# Altium schematic sheet HDMI.SchDoc
size A4; SheetNumber: 11; SheetTotal: 11
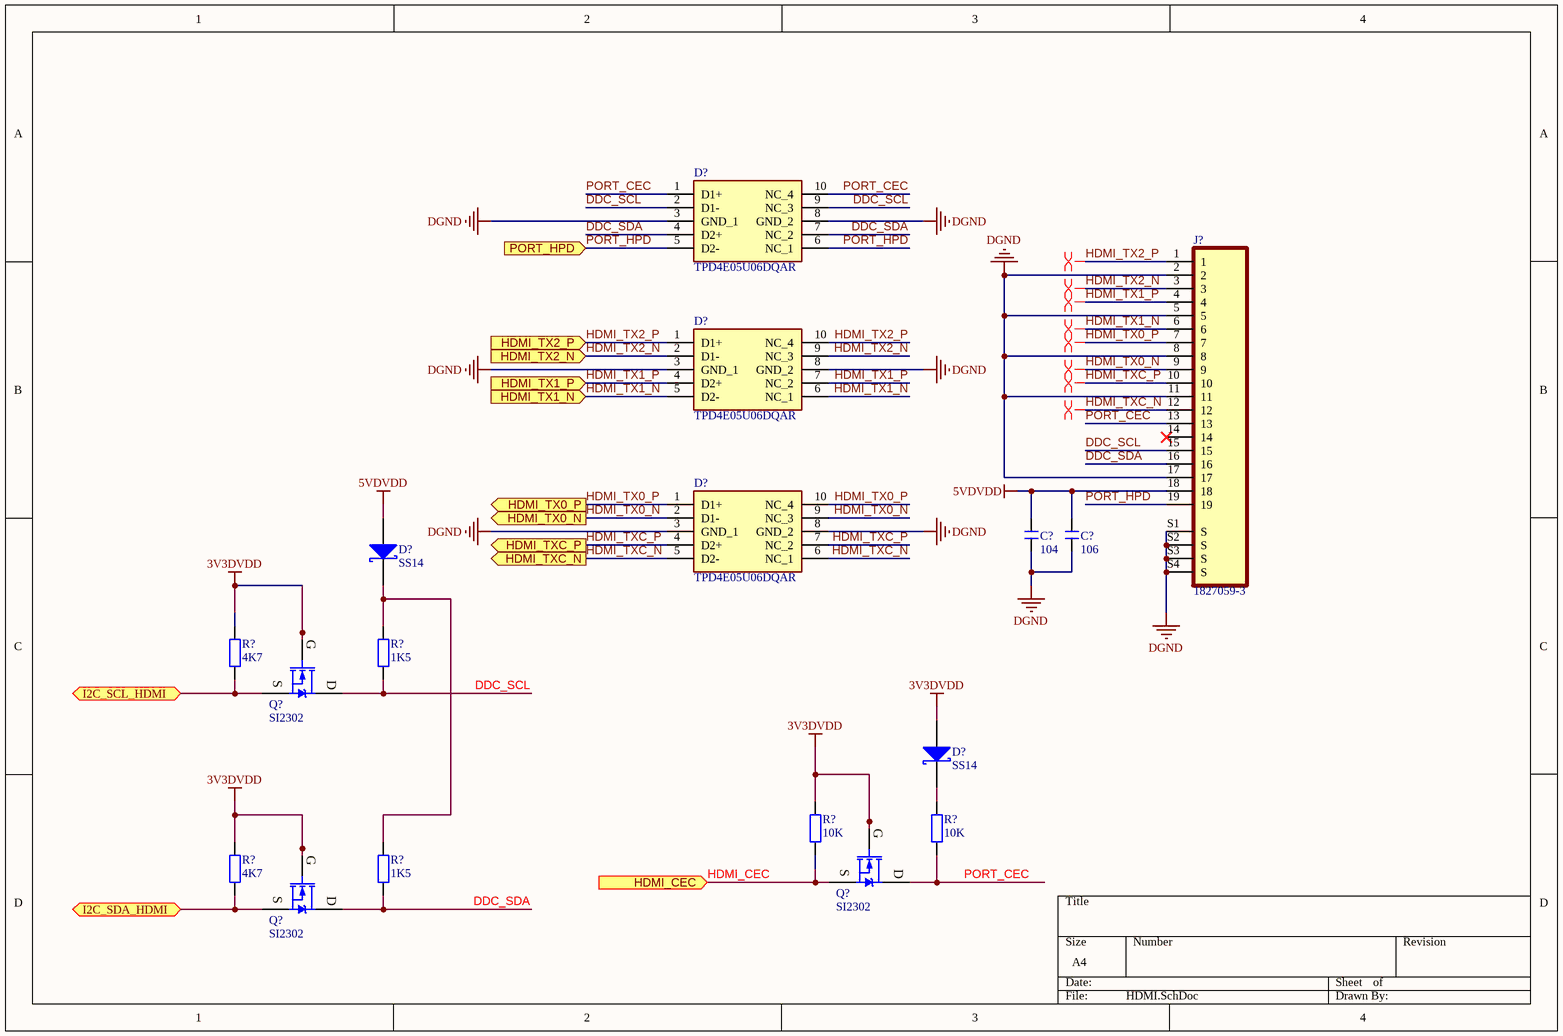
[diagram p0: HDMI.SchDoc]

## Parts
(Parts that share a designator on the sheet are numbered #1, #2 ... from top to bottom, then left to right.)
C?#1  104  [C 0603_L]
C?#2  106  [C 0603_L]
D?#1  TPD4E05U06DQAR  [DQA(R-PUSON-N10)]
D?#2  TPD4E05U06DQAR  [DQA(R-PUSON-N10)]
D?#3  TPD4E05U06DQAR  [DQA(R-PUSON-N10)]
D?#4  SS14  [SMA]
D?#5  SS14  [SMA]
J?  1827059-3  [TE_1827059-3]
Q?#1  SI2302  [SOT23-3N]
Q?#2  SI2302  [SOT23-3N]
Q?#3  SI2302  [SOT23-3N]
R?#1  4K7  [R 0603_L]
R?#2  1K5  [R 0603_L]
R?#3  10K  [R 0603_L]
R?#4  10K  [R 0603_L]
R?#5  4K7  [R 0603_L]
R?#6  1K5  [R 0603_L]

## Ports
HDMI_CEC (in), HDMI_TX0_N (out), HDMI_TX0_P (out), HDMI_TX1_N (in), HDMI_TX1_P (in), HDMI_TX2_N (in), HDMI_TX2_P (in), HDMI_TXC_N (out), HDMI_TXC_P (out), I2C_SCL_HDMI (bidir), I2C_SDA_HDMI (bidir), PORT_HPD (in)

## Nets
3V3DVDD: D?#5.1(A) Q?#1.1(G) Q?#2.1(G) Q?#3.1(G) R?#1.2 R?#3.2 R?#5.2
5VDVDD: C?#1.2 C?#2.2 D?#4.1(A) J?.18
DGND: C?#1.1 C?#2.1 D?#1.3(GND_1) D?#1.8(GND_2) D?#2.3(GND_1) D?#2.8(GND_2) D?#3.3(GND_1) D?#3.8(GND_2) J?.2 J?.5 J?.8 J?.11 J?.17 J?.S1(S) J?.S2(S) J?.S3(S) J?.S4(S)
DDC_SCL: D?#1.2(D1-) D?#1.9(NC_3) J?.15 Q?#1.3(D) R?#2.1
DDC_SDA: D?#1.4(D2+) D?#1.7(NC_2) J?.16 Q?#3.3(D) R?#6.1
HDMI_CEC: Q?#2.2(S) R?#3.1 ; port HDMI_CEC
HDMI_TX0_N: D?#3.2(D1-) D?#3.9(NC_3) J?.9 ; port HDMI_TX0_N
HDMI_TX0_P: D?#3.1(D1+) D?#3.10(NC_4) J?.7 ; port HDMI_TX0_P
HDMI_TX1_N: D?#2.5(D2-) D?#2.6(NC_1) J?.6 ; port HDMI_TX1_N
HDMI_TX1_P: D?#2.4(D2+) D?#2.7(NC_2) J?.4 ; port HDMI_TX1_P
HDMI_TX2_N: D?#2.2(D1-) D?#2.9(NC_3) J?.3 ; port HDMI_TX2_N
HDMI_TX2_P: D?#2.1(D1+) D?#2.10(NC_4) J?.1 ; port HDMI_TX2_P
HDMI_TXC_N: D?#3.5(D2-) D?#3.6(NC_1) J?.12 ; port HDMI_TXC_N
HDMI_TXC_P: D?#3.4(D2+) D?#3.7(NC_2) J?.10 ; port HDMI_TXC_P
I2C_SCL_HDMI: Q?#1.2(S) R?#1.1 ; port I2C_SCL_HDMI
I2C_SDA_HDMI: Q?#3.2(S) R?#5.1 ; port I2C_SDA_HDMI
PORT_CEC: D?#1.1(D1+) D?#1.10(NC_4) J?.13 Q?#2.3(D) R?#4.1
PORT_HPD: D?#1.5(D2-) D?#1.6(NC_1) J?.19 ; port PORT_HPD
NetD?#4_2: D?#4.2(K) R?#2.2 R?#6.2
NetD?#5_2: D?#5.2(K) R?#4.2

Not connected (* = marked no-connect by the designer): J? 14*

## Layout directives
differential pair: HDMI_TX0_N, HDMI_TX0_P, HDMI_TX1_N, HDMI_TX1_P, HDMI_TX2_N, HDMI_TX2_P, HDMI_TXC_N, HDMI_TXC_P

## Library data of the parts
C?#1 C?#2 = C: 贴片电容; BOM名称: 无极性贴片电容; 淘宝ID: 封装库来自淘宝 ID：黄晶宝石; 联系售后，技术支持: https://shop463601444.taobao.com; 唯一出售店铺网址: https://shop463601444.taobao.com
D?#1-D?#3 = TPD4E05U06DQAR: Diode; Manufacturer_Name: Texas Instruments; Datasheet Link: http://www.ti.com/lit/gpn/tpd4e05u06; Manufacturer_Part_Number: TPD4E05U06DQAR; Mouser Part Number: 595-TPD4E05U06DQAR; Mouser Price/Stock: https://www.mouser.co.uk/ProductDetail/Texas-Instruments/TPD4E05U06DQAR?qs=%2FCrDlo5IrVPi4woOvWz0qA%3D%3D; Arrow Part Number: TPD4E05U06DQAR; Arrow Price/Stock: https://www.arrow.com/en/products/tpd4e05u06dqar/texas-instruments?region=nac
D?#4 D?#5 = SS14: 肖特基二极管; 属性: 40V/1A; BOM名称: 肖特基二极管; 封装库来自淘宝 ID：黄晶宝石: https://shop463601444.taobao.com
J? = 1827059-3: EMBOSS PACKAGE HDMI CONN SMT NO-FLANGE T; MF: TE Connectivity; Price: None; Availability: In Stock; MP: 1827059-3; Package: None; SnapEDA_Link: https://www.snapeda.com/parts/1827059-3/TE+Connectivity+AMP+Connectors/view-part/?ref=snap; Check_prices: https://www.snapeda.com/parts/1827059-3/TE+Connectivity+AMP+Connectors/view-part/?ref=eda; Value: *; EU_RoHS_Compliance: Compliant; Purchase-URL: https://pricing.snapeda.com/search/part/1827059-3/?ref=eda
Q?#1-Q?#3 = SI2302: N沟道场效应管; 技术支持，联系售后: 封装库来自淘宝 ID：黄晶宝石; BOM名称: N沟道场效应管; 学习资源: https://shop463601444.taobao.com
R?#1-R?#6 = R: 贴片电阻; 版权归属: 来自淘宝 ID：黄晶宝石; 封装库来自淘宝卖家 ID：黄晶宝石: 其他店铺购入均为盗版，不享受售后技术支持服务，请立即申请退款; BOM名称: 贴片电阻; 联系售后: https://shop463601444.taobao.com